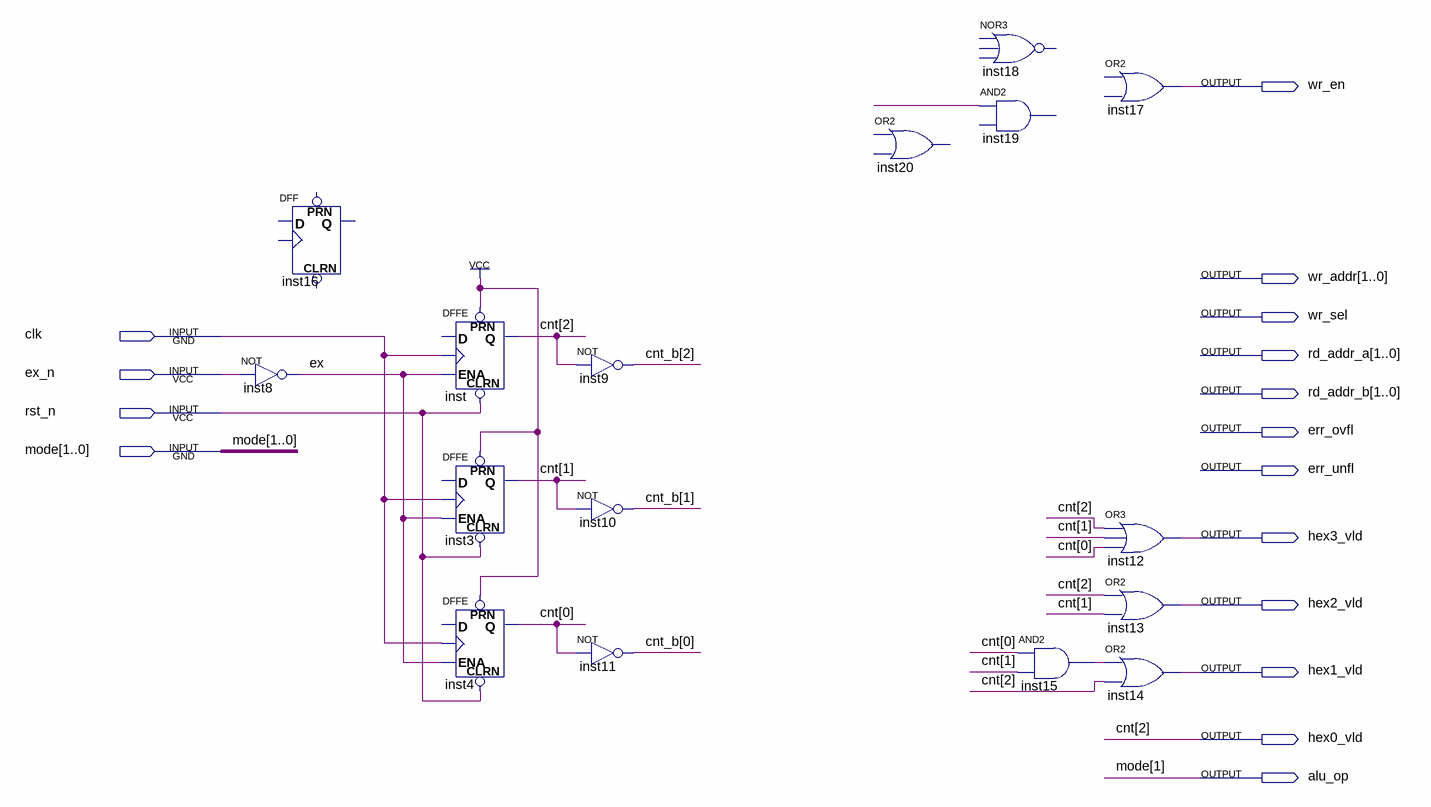
[diagram p0: schematic sheet]
// Quartus schematic control.bdf as structural Verilog: 16 symbols, 16 pins
module control (
  input  clk,
  input  ex_n,
  input  rst_n,
  input  [1:0] mode,
  output wr_en,
  output [1:0] wr_addr,
  output wr_sel,
  output [1:0] rd_addr_a,
  output [1:0] rd_addr_b,
  output err_ovfl,
  output err_unfl,
  output hex3_vld,
  output hex2_vld,
  output hex1_vld,
  output hex0_vld,
  output alu_op
);

  wire ex, inst15_out, undriven;
  wire [1:0] cnt;
  wire [2:0] cnt_b;

  DFF inst16 ();  // open: CLRN, CLK, D, PRN, Q
  not inst8 (ex, ex_n);
  DFFE inst (.PRN(1'b1), .CLRN(rst_n), .CLK(clk), .ENA(ex), .Q(hex0_vld));  // open: D
  DFFE inst3 (.PRN(1'b1), .CLRN(rst_n), .CLK(clk), .ENA(ex), .Q(cnt[1]));  // open: D
  DFFE inst4 (.PRN(1'b1), .CLRN(rst_n), .CLK(clk), .ENA(ex), .Q(cnt[0]));  // open: D
  not inst9 (cnt_b[2], hex0_vld);
  not inst10 (cnt_b[1], cnt[1]);
  not inst11 (cnt_b[0], cnt[0]);
  // OR2 inst20 is placed but not wired
  // NOR3 inst18 is placed but not wired
  // AND2 inst19 has open pins: IN1=undriven, IN2=open, OUT=open
  and inst15 (inst15_out, cnt[0], cnt[1]);
  // OR2 inst17 has open pins: IN1=open, IN2=open, OUT=wr_en
  or inst12 (hex3_vld, hex0_vld, cnt[1], cnt[0]);
  or inst13 (hex2_vld, hex0_vld, cnt[1]);
  or inst14 (hex1_vld, inst15_out, hex0_vld);

  assign alu_op = mode[1];

  // Other names for the same wires on the sheet: cnt[2] = hex0_vld
endmodule
